# EAGLE design detektor daging celelng (EAGLE 7.2.0)
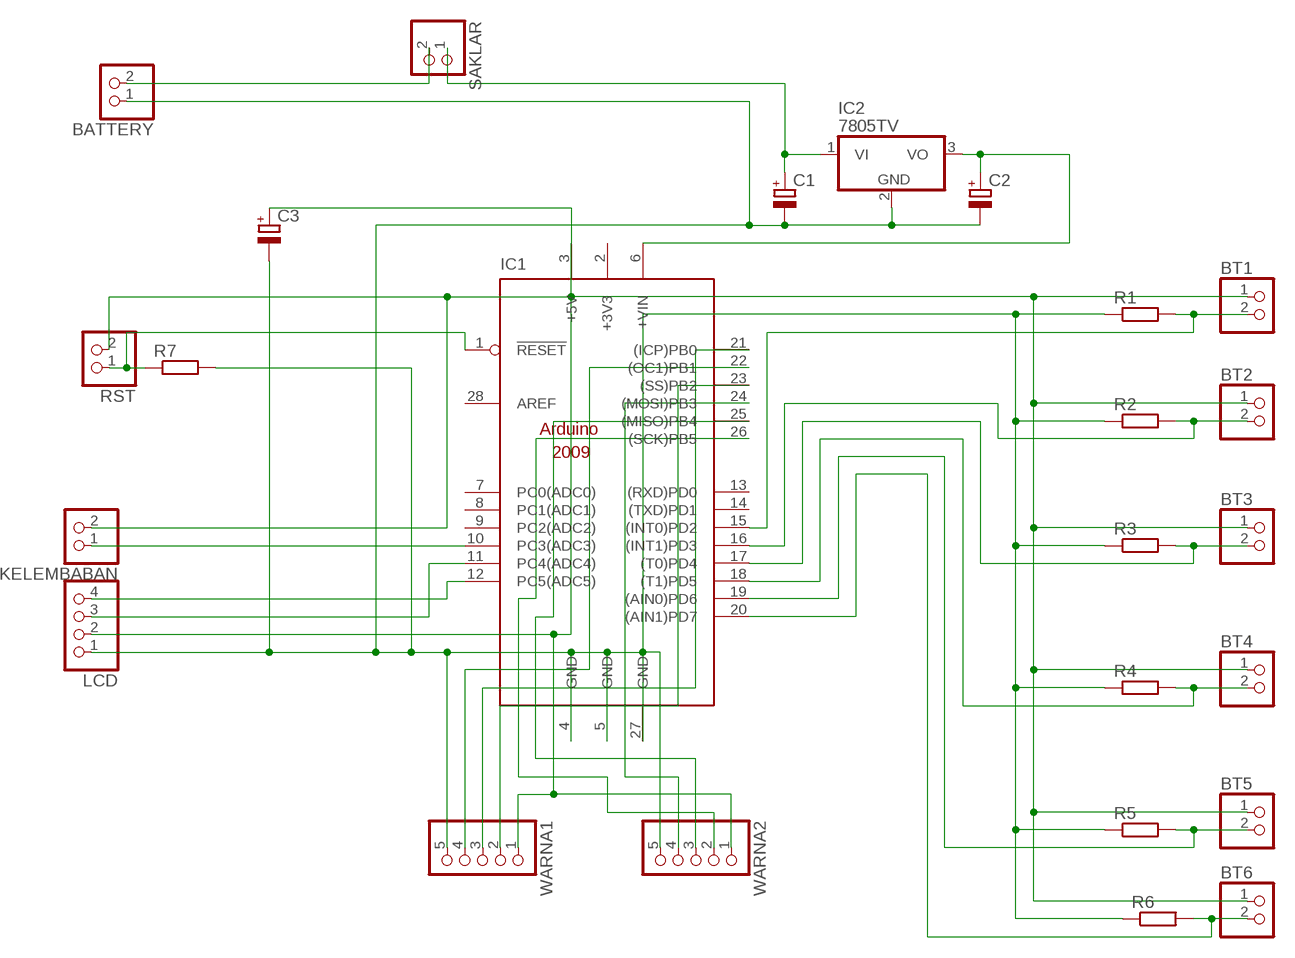
[diagram p0: schematic, sheet 1]

## Parts
BATTERY  PINHD-1X2  [1X02]
BT1  PINHD-1X2  [1X02]
BT2  PINHD-1X2  [1X02]
BT3  PINHD-1X2  [1X02]
BT4  PINHD-1X2  [1X02]
BT5  PINHD-1X2  [1X02]
BT6  PINHD-1X2  [1X02]
C1  CPOL-EUE2.5-7  [E2,5-7]
C2  CPOL-EUE2.5-7  [E2,5-7]
C3  CPOL-EUE2.5-7  [E2,5-7]
IC1  ARDUINO2009_PIN_10  [ARDUINO2009]
IC2  7805TV  [TO220V]
KELEMBABAN  PINHD-1X2  [1X02]
LCD  PINHD-1X4  [1X04]
R1  R-EU_0207/10  [0207/10]
R2  R-EU_0207/10  [0207/10]
R3  R-EU_0207/10  [0207/10]
R4  R-EU_0207/10  [0207/10]
R5  R-EU_0207/10  [0207/10]
R6  R-EU_0207/10  [0207/10]
R7  R-EU_0207/10  [0207/10]
RST  PINHD-1X2  [1X02]
SAKLAR  PINHD-1X2  [1X02]
WARNA1  PINHD-1X5  [1X05]
WARNA2  PINHD-1X5  [1X05]

## Nets
N$1: BT1.1 BT2.1 BT3.1 BT4.1 BT5.1 BT6.1 C3.+ IC1.3(+5V) KELEMBABAN.2 LCD.2 RST.2 WARNA1.1 WARNA2.1
N$2: BT3.2 IC1.17((T0)PD4) R3.2
N$3: BT4.2 IC1.18((T1)PD5) R4.2
N$4: BT2.2 IC1.16((INT1)PD3) R2.2
N$5: BT1.2 IC1.15((INT0)PD2) R1.2
N$7: BT5.2 IC1.19((AIN0)PD6) R5.2
N$8: BT6.2 IC1.20((AIN1)PD7) R6.2
N$9: IC1.12(PC5(ADC5)) LCD.4
N$10: IC1.11(PC4(ADC4)) LCD.3
N$11: C1.+ IC2.1(VI) SAKLAR.1
N$12: C2.+ IC1.6(+VIN) IC2.3(VO)
N$13: BATTERY.1 C1.- C2.- C3.- IC1.4(GND) IC1.5(GND) IC1.27(GND) IC2.2(GND) LCD.1 R1.1 R2.1 R3.1 R4.1 R5.1 R6.1 R7.2 WARNA1.5 WARNA2.5
N$14: IC1.22((OC1)PB1) WARNA1.4
N$15: IC1.21((ICP)PB0) WARNA1.3
N$16: IC1.23((SS)PB2) WARNA1.2
N$17: IC1.24((MOSI)PB3) WARNA2.4
N$18: IC1.25((MISO)PB4) WARNA2.3
N$19: IC1.26((SCK)PB5) WARNA2.2
N$20: IC1.10(PC3(ADC3)) KELEMBABAN.1
N$21: BATTERY.2 SAKLAR.2
N$23: IC1.1(!RESET) R7.1 RST.1
Unconnected: IC1.7(PC0(ADC0)) IC1.8(PC1(ADC1)) IC1.9(PC2(ADC2)) IC1.13((RXD)PD0) IC1.14((TXD)PD1) IC1.28(AREF)

## Power pins joined to a net without a drawn wire
+3V3: IC1.2(+3V3)

## Library data of the parts
BATTERY BT1-BT6 KELEMBABAN RST SAKLAR = pinhead:PINHD-1X2: PIN HEADER
C1-C3 = rcl:CPOL-EU: POLARIZED CAPACITOR, European symbol
IC1 = arduino (2):ARDUINO2009_PIN_1: The Arduino Duemilanove ("2009") is a microcontroller board based on the ATmega168 or ATmega328. - 14 digital input/output pins (of which 6 can be used as PWM outputs) - 6 analog inputs, a 16 MHz crystal oscillator - USB connection - power jack - ISP header - reset button It contains everything needed to support the microcontroller; simply connect it to a computer with a USB cable or power it with a AC-to-DC adapter or battery to get started http://arduino.cc/en/Main/ArduinoBoardDuemilanove
IC2 = linear:78*: Positive VOLTAGE REGULATOR Source: http://cache.national.com/ds/LM/LM78L05.pdf http://www.fairchildsemi.com/ds/LM/LM7805.pdf
LCD = pinhead:PINHD-1X4: PIN HEADER
R1-R7 = rcl:R-EU_: RESISTOR, European symbol
WARNA1 WARNA2 = pinhead:PINHD-1X5: PIN HEADER

## Board
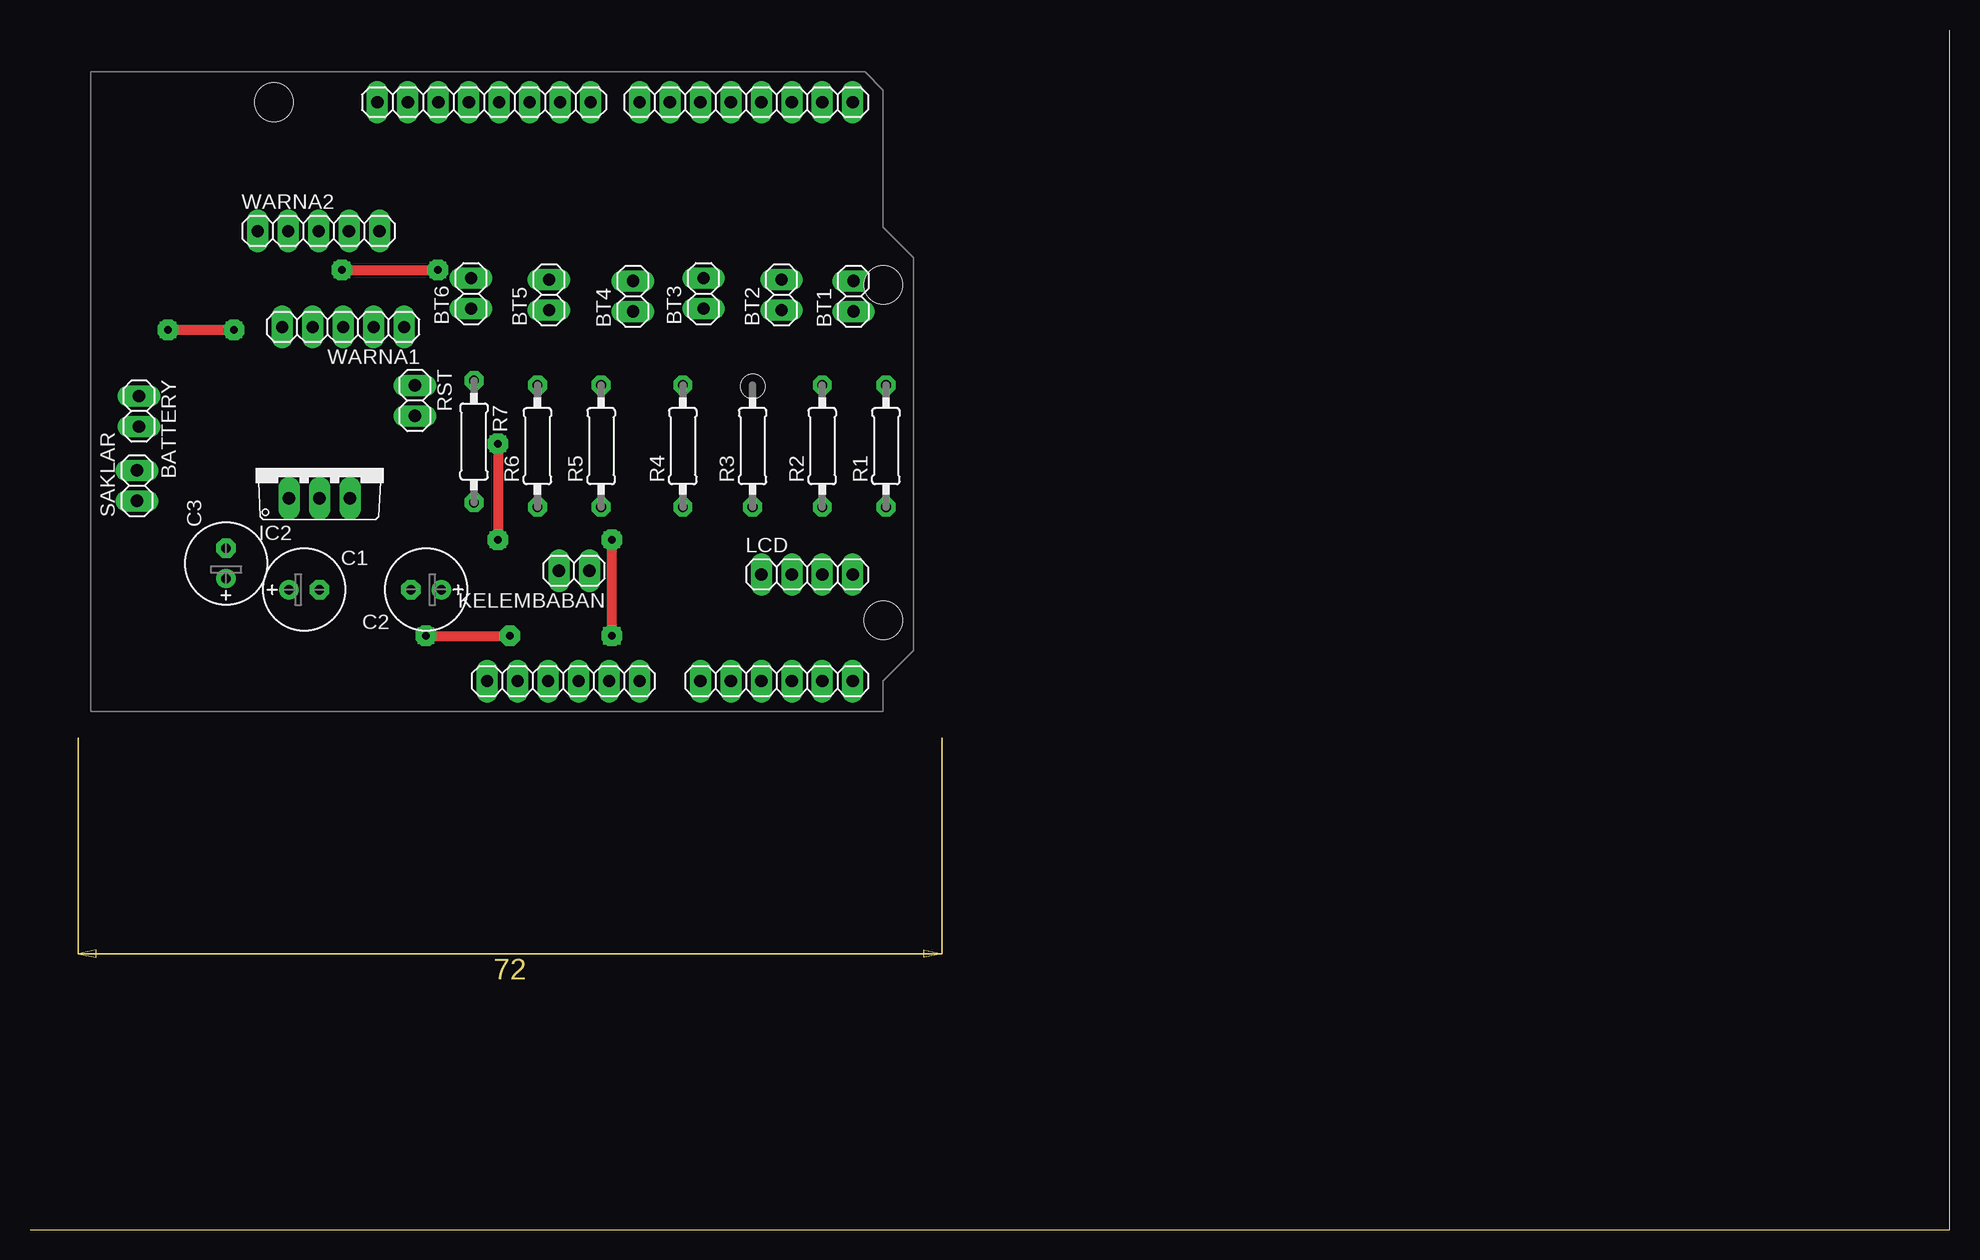
[diagram p1: board, top side]
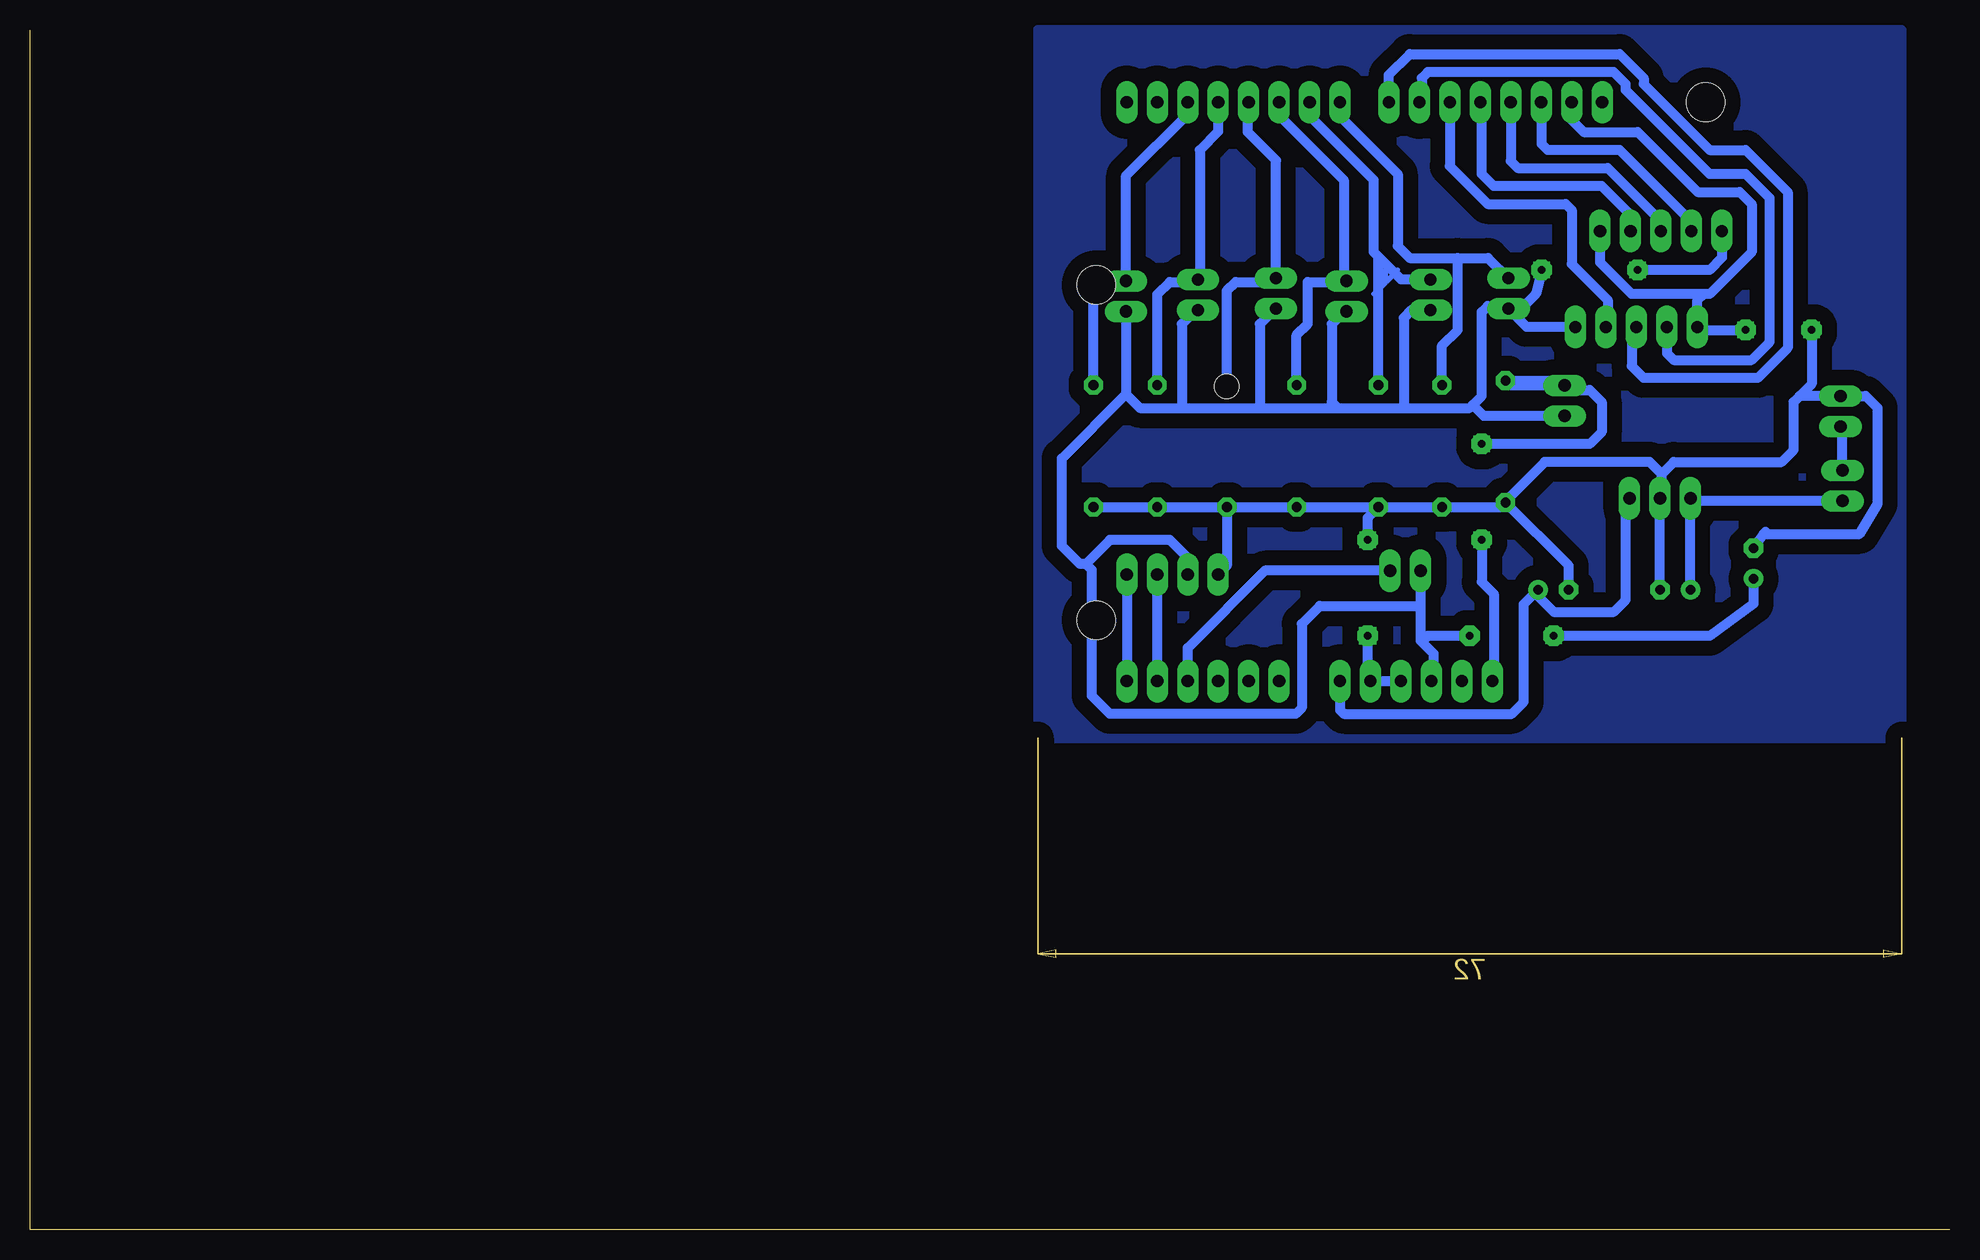
[diagram p2: board, bottom side, seen from below]

Size 160 x 100 mm. Coordinates in mm from the lower left corner, seen from the top.
Outline: 0,0 160,0 160,100
Copper layers (1*16): Top 0.035mm / dielectric 1.5mm / Bottom 0.035mm
Design rules "default *": minimum track width 10mil, minimum drill 24mil, track to track 8mil, track to pad 8mil, pad to pad 8mil, via to via 8mil, smd to smd 8mil, copper to edge 40mil, drill to drill 8mil, minimum pad ring 15mil, minimum via ring 15mil, stop-mask expansion 4mil, vias tented up to drill 0mil, thermal gap 10mil

### Footprints (pad centres in the part's own frame; a part is rotated, then mirrored left to right if it is on the bottom)
1X02 = drill 1.016 long: 1 -1.27,0; 2 1.27,0
E2,5-7 = drill 0.813 pad 1.6: + -1.27,0 | drill 0.813 pad 1.6 octagon: - 1.27,0
ARDUINO2009 = drill 1.016 long: 1 33.02,2.54; 2 35.56,2.54; 3 38.1,2.54; 4 40.64,2.54; 5 43.18,2.54; 6 45.72,2.54; 7 50.8,2.54; 8 53.34,2.54; 9 55.88,2.54; 10 58.42,2.54; 11 60.96,2.54; 12 63.5,2.54; 13 63.5,50.8; 14 60.96,50.8; 15 58.42,50.8; 16 55.88,50.8; 17 53.34,50.8; 18 50.8,50.8; 19 48.26,50.8; 20 45.72,50.8; 21 41.656,50.8; 22 39.116,50.8; 23 36.576,50.8; 24 34.036,50.8; 25 31.496,50.8; 26 28.956,50.8; 27 26.416,50.8; 28 23.876,50.8 | hole 3.2: 15.24,50.8; 66.04,35.56; 66.04,7.62 | hole 2: 55.17,27.114
TO220V = drill 1.016 long: 1 -2.54,-2.54; 2 0,-2.54; 3 2.54,-2.54
1X04 = drill 1.016 long: 1 -3.81,0; 2 -1.27,0; 3 1.27,0; 4 3.81,0
0207/10 = drill 0.813 octagon: 1 -5.08,0; 2 5.08,0
1X05 = drill 1.016 long: 1 -5.08,0; 2 -2.54,0; 3 0,0; 4 2.54,0; 5 5.08,0

### Placement (x,y rotation side)
BATTERY  9.08,68.22 270 top
BT1  68.64,77.81 90 top
BT2  62.64,77.92 90 top
BT3  56.14,78.03 90 top
BT4  50.26,77.81 90 top
BT5  43.26,77.92 90 top
BT6  36.76,78.03 90 top
C1  22.86,53.34 0 top
C2  33.02,53.34 180 top
C3  16.34,55.53 90 top
IC1  5.08,43.18 0 top
IC2  24.13,63.5 0 top
KELEMBABAN  45.36,54.92 180 top
LCD  64.77,54.61 0 top
R1  71.35,65.31 90 top
R2  66.04,65.31 90 top
R3  60.23,65.31 90 top
R4  54.42,65.31 90 top
R5  47.61,65.31 90 top
R6  42.3,65.31 90 top
R7  37.01,65.69 270 top
RST  32.08,69.1 270 top
SAKLAR  8.92,62.02 90 top
WARNA1  26.1,75.24 180 top
WARNA2  24.05,83.24 0 top

### Tracks (layer width: path | path; a pad name or v marks a point on that pad's centre or on a via)
N$1  (via drill 0.6, 0.6 pad 1.68)
  Top 0.813: v26,80 v34,80 | v33,49.5 v40,49.5
  Bottom 0.813: LCD.2 63.5,56 65,57.5 70,57.5 72,55.5 | IC1.3 43,45.9 43,48 44,49 | BT1.1 68.64,69.64 | 68.64,69.64 67.5,68.5 64,68.5 | 64,68.5 57.5,68.5 | 57.5,68.5 51,68.5 | 51,68.5 45.5,68.5 | 45.5,68.5 40,68.5 39.75,68.75 | 39.75,68.75 39,69.5 39,76.5 38.5,77 37,77 BT6.1 | BT5.1 44.85,76.65 45.5,76 45.5,68.5 | BT4.1 50.46,76.54 51.5,75.5 51.5,69 51,68.5 | BT3.1 56.24,76.76 57.5,75.5 57.5,68.5 | BT2.1 62.85,76.65 64,75.5 64,68.5 | 72,55.5 72.5,55.5 74,57 74,64.28 68.64,69.64 | 44,49 44.09,49.09 44.09,52 | 72,55.5 71.5,55 71.5,44.5 70,43 54.5,43 54,43.5 54,50.5 52.5,52 44.09,52 | KELEMBABAN.2 44.09,52 | RST.2 38.83,67.83 39.75,68.75 | WARNA1.1 35.24,75.24 BT6.1 | WARNA2.1 18.97,81.03 20,80 v26,80 | C3.+ 16.34,52.16 20,49.5 v33,49.5 | v34,80 34.5,78 35.5,77 36.52,77 BT6.1 | v40,49.5 43.5,49.5 44,49
N$2
  Bottom 0.813: IC1.17 58.5,93.9 58.5,91.5 56.14,89.14 BT3.2 56.44,79 59.5,79 60.23,78.27 R3.2
N$3
  Bottom 0.813: IC1.18 55.88,92.88 50.5,87.5 50.5,79.32 BT4.2 50.34,79 53.5,79 53.5,75.5 54.42,74.58 R4.2
N$4
  Bottom 0.813: IC1.16 60.96,91.54 62.5,90 62.5,79.33 BT2.2 62.83,79 65,79 66.04,77.96 R2.2
N$5
  Bottom 0.813: IC1.15 63.5,93 68.64,87.86 BT1.2 68.72,79 70.5,79 71.35,78.15 R1.2
N$6
  pour Bottom (isolate 1.27): 4,100 76,100 76,41 4,41
N$7
  Bottom 0.813: IC1.19 53.5,93.82 53.5,93 48,87.5 48,81.5 47.75,81.25 47.61,81.11 | BT5.2 45.69,79.19 47.61,81.11 | R5.2 47.61,81.11
N$8
  Bottom 0.813: IC1.20 50.8,92.8 46,88 46,82 45,81 41,81 | 41,81 38.46,81 BT6.2 | R6.2 42.3,73.7 41,75 41,81
N$9
  Bottom 0.813: LCD.4 IC1.12
N$10
  Bottom 0.813: IC1.11 LCD.3
N$11
  Bottom 0.813: C1.+ IC2.1 21.38,60.75 SAKLAR.1
N$12
  Bottom 0.813: IC2.3 27,60.63 27,52.5 28,51.5 33,51.5 34.29,52.79 C2.+ 35.5,52.13 35.5,44 36.5,43 50.5,43 50.8,43.3 IC1.6
N$13  (via drill 0.6, 0.6 pad 1.42, 0.6 pad 1.68)
  Top 0.813: v17,75 v11.5,75 | v48.5,49.5 v48.5,57.5
  Bottom 0.813: WARNA2.5 29.13,80.63 26.5,78 20.5,78 | 21,75.26 WARNA1.5 | IC1.27 31.5,92.5 30.5,91.5 26,91.5 21,86.5 17.5,86.5 16.5,85.5 16.5,81.5 20,78 20.5,78 | R1.1 R2.1 R3.1 | R3.1 R4.1 R5.1 | R5.1 R6.1 37.5,60.23 | 37.5,60.23 37.39,60.23 R7.2 31.75,55.35 C2.- | R3.1 60.23,55.34 LCD.1 | IC1.4 IC1.5 48.5,45.72 v48.5,49.5 | C1.- IC2.2 24,61.09 24,63 | 37.5,60.23 33.73,64 25,64 24,63 | 12.5,69.49 BATTERY.1 6.99,69.49 6,68.5 6,60.5 7.5,58 15.5,58 15.34,58.16 C3.- | WARNA1.5 21.02,77.48 20.5,78 | WARNA1.5 21.02,75 v17,75 | v48.5,57.5 48.5,59.34 R5.1 | 24,63 23,64 14,64 13,65 13,68.99 12.5,69.49 | v11.5,75 11.5,70.49 12.5,69.49
N$14
  Bottom 0.813: WARNA1.4 23.56,73.06 23,72.5 16.5,72.5 15,74 15,86 17,88 20,88 27,95 27,95.5 28,96.5 43.5,96.5 44,96 44,94.18 IC1.22
N$15
  Bottom 0.813: IC1.21 46.74,96.26 45,98 27.5,98 25.5,96 25.5,95.5 20,90 17,90 13.5,86.5 13.5,73.5 16,71 25.5,71 26.5,72 26.5,74.84 WARNA1.3
N$16
  Bottom 0.813: IC1.23 41.66,88.66 38.5,85.5 32,85.5 31.5,85 31.5,80.5 28.5,77.5 28.5,75.38 WARNA1.2
N$17
  Bottom 0.813: WARNA2.4 26.59,84.59 29,87 38,87 39,88 39,93.86 IC1.24
N$18
  Bottom 0.813: IC1.25 36.58,89.08 36,88.5 28.5,88.5 24,84 24,83.5 24.5,83 24.29,83 WARNA2.3
N$19
  Bottom 0.813: WARNA2.2 21.51,84.01 27.5,90 33.5,90 34,90.5 34,93.94 IC1.26
N$20
  Bottom 0.813: IC1.10 63.5,48.5 57.08,54.92 KELEMBABAN.1
N$21
  Bottom 0.813: SAKLAR.2 8.92,66.79 BATTERY.2
N$22
  Bottom 0.406: 48,78 47,79 | 46,80 47,79 | 47,79 47,80
N$23  (via drill 0.6, 0.6 pad 1.68)
  Top 0.813: v39,65.5 v39,57.5
  Bottom 0.813: RST.1 36.61,70.37 R7.1 33.27,70.77 32.5,70 30,70 29,69 29,66.5 30,65.5 v39,65.5 | v39,57.5 39,54 38,53 38,45.82 IC1.1